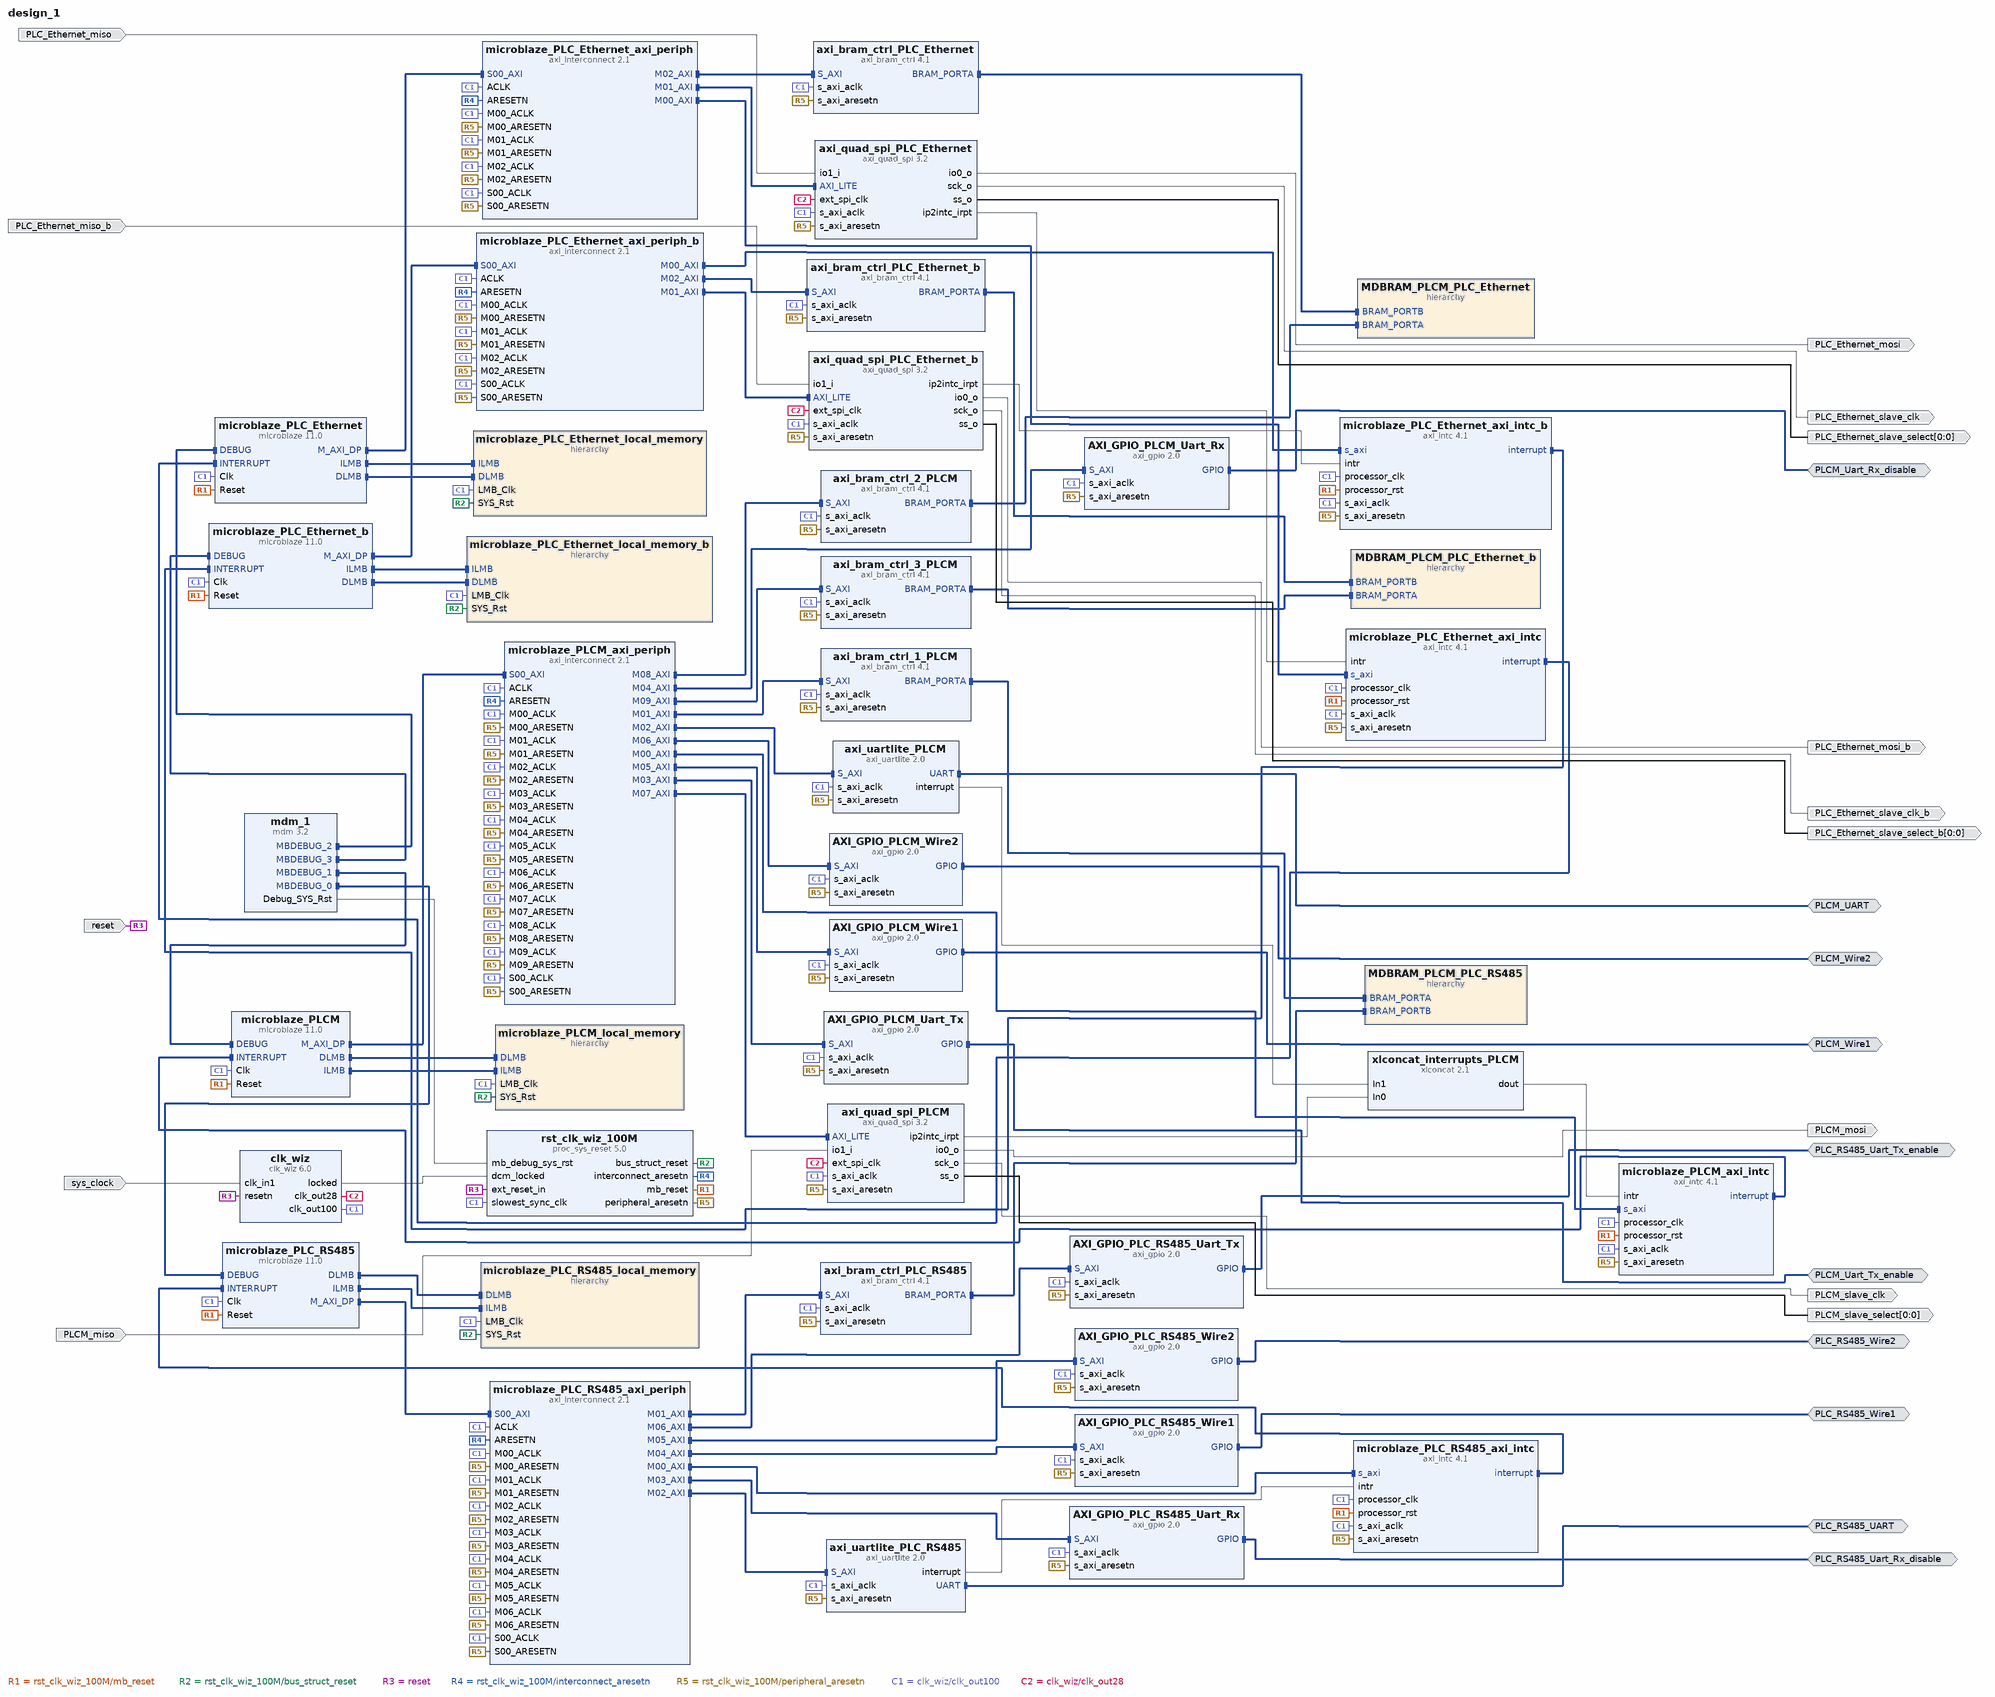
[diagram p0: block diagram of the top level]
# Vivado block design design_1, xc7z020clg400-1, Vivado 2019.1
create_bd_design design_1

create_bd_intf_port -mode Master -vlnv xilinx.com:interface:uart_rtl:1.0 PLC_RS485_UART
create_bd_intf_port -mode Master -vlnv xilinx.com:interface:uart_rtl:1.0 PLCM_UART
create_bd_intf_port -mode Master -vlnv xilinx.com:interface:gpio_rtl:1.0 PLC_RS485_Uart_Rx_disable
create_bd_intf_port -mode Master -vlnv xilinx.com:interface:gpio_rtl:1.0 PLCM_Uart_Rx_disable
create_bd_intf_port -mode Master -vlnv xilinx.com:interface:gpio_rtl:1.0 PLCM_Uart_Tx_enable
create_bd_intf_port -mode Master -vlnv xilinx.com:interface:gpio_rtl:1.0 PLC_RS485_Wire1
create_bd_intf_port -mode Master -vlnv xilinx.com:interface:gpio_rtl:1.0 PLC_RS485_Wire2
create_bd_intf_port -mode Master -vlnv xilinx.com:interface:gpio_rtl:1.0 PLCM_Wire1
create_bd_intf_port -mode Master -vlnv xilinx.com:interface:gpio_rtl:1.0 PLCM_Wire2
create_bd_intf_port -mode Master -vlnv xilinx.com:interface:gpio_rtl:1.0 PLC_RS485_Uart_Tx_enable
create_bd_port -dir I -type clk sys_clock
set_property -dict {CONFIG.FREQ_HZ 125000000 CONFIG.PHASE 0.000} [get_bd_ports sys_clock]
create_bd_port -dir I -type rst reset
set_property -dict {CONFIG.POLARITY ACTIVE_LOW} [get_bd_ports reset]
create_bd_port -dir O PLCM_mosi
create_bd_port -dir I PLCM_miso
create_bd_port -dir O PLCM_slave_clk
create_bd_port -dir O -from 0 -to 0 PLCM_slave_select
create_bd_port -dir I PLC_Ethernet_miso
create_bd_port -dir O PLC_Ethernet_mosi
create_bd_port -dir O PLC_Ethernet_slave_clk
create_bd_port -dir O -from 0 -to 0 PLC_Ethernet_slave_select
create_bd_port -dir I PLC_Ethernet_miso_b
create_bd_port -dir O PLC_Ethernet_mosi_b
create_bd_port -dir O PLC_Ethernet_slave_clk_b
create_bd_port -dir O -from 0 -to 0 PLC_Ethernet_slave_select_b

create_bd_cell -type ip -vlnv xilinx.com:ip:microblaze:11.0 microblaze_PLC_RS485
set_property -dict [list \
  CONFIG.C_DEBUG_ENABLED 1 \
  CONFIG.C_D_AXI 1 \
  CONFIG.C_D_LMB 1 \
  CONFIG.C_I_LMB 1 \
] [get_bd_cells microblaze_PLC_RS485]
create_bd_cell -type ip -vlnv xilinx.com:ip:microblaze:11.0 microblaze_PLCM
set_property -dict {CONFIG.C_DEBUG_ENABLED 1 CONFIG.C_D_AXI 1 CONFIG.C_D_LMB 1 CONFIG.C_I_LMB 1} [get_bd_cells microblaze_PLCM]
create_bd_cell -type ip -vlnv xilinx.com:ip:clk_wiz:6.0 clk_wiz
set_property -dict [list \
  CONFIG.CLKIN1_JITTER_PS 80.0 \
  CONFIG.CLKOUT1_JITTER 290.778 \
  CONFIG.CLKOUT1_PHASE_ERROR 301.898 \
  CONFIG.CLKOUT1_REQUESTED_OUT_FREQ 100.000 \
  CONFIG.CLKOUT2_JITTER 374.460 \
  CONFIG.CLKOUT2_PHASE_ERROR 301.898 \
  CONFIG.CLKOUT2_REQUESTED_OUT_FREQ 28.000 \
  CONFIG.CLKOUT2_USED true \
  CONFIG.CLK_IN1_BOARD_INTERFACE sys_clock \
  CONFIG.CLK_OUT1_PORT clk_out100 \
  CONFIG.CLK_OUT2_PORT clk_out28 \
  CONFIG.MMCM_CLKFBOUT_MULT_F 28.000 \
  CONFIG.MMCM_CLKIN1_PERIOD 8.000 \
  CONFIG.MMCM_CLKIN2_PERIOD 10.0 \
  CONFIG.MMCM_CLKOUT0_DIVIDE_F 7.000 \
  CONFIG.MMCM_CLKOUT1_DIVIDE 25 \
  CONFIG.MMCM_DIVCLK_DIVIDE 5 \
  CONFIG.NUM_OUT_CLKS 2 \
  CONFIG.RESET_PORT resetn \
  CONFIG.RESET_TYPE ACTIVE_LOW \
  CONFIG.USE_BOARD_FLOW true \
] [get_bd_cells clk_wiz]
create_bd_cell -type hier microblaze_PLC_RS485_local_memory
create_bd_cell -type ip -vlnv xilinx.com:ip:axi_interconnect:2.1 microblaze_PLC_RS485_axi_periph
set_property -dict {CONFIG.NUM_MI 7} [get_bd_cells microblaze_PLC_RS485_axi_periph]
create_bd_cell -type ip -vlnv xilinx.com:ip:axi_intc:4.1 microblaze_PLC_RS485_axi_intc
set_property -dict {CONFIG.C_HAS_FAST 1} [get_bd_cells microblaze_PLC_RS485_axi_intc]
create_bd_cell -type ip -vlnv xilinx.com:ip:mdm:3.2 mdm_1
set_property -dict {CONFIG.C_ADDR_SIZE 32 CONFIG.C_MB_DBG_PORTS 4 CONFIG.C_M_AXI_ADDR_WIDTH 32} [get_bd_cells mdm_1]
create_bd_cell -type ip -vlnv xilinx.com:ip:proc_sys_reset:5.0 rst_clk_wiz_100M
create_bd_cell -type hier microblaze_PLCM_local_memory
create_bd_cell -type ip -vlnv xilinx.com:ip:axi_interconnect:2.1 microblaze_PLCM_axi_periph
set_property -dict {CONFIG.NUM_MI 10} [get_bd_cells microblaze_PLCM_axi_periph]
create_bd_cell -type ip -vlnv xilinx.com:ip:axi_intc:4.1 microblaze_PLCM_axi_intc
set_property -dict {CONFIG.C_HAS_FAST 1} [get_bd_cells microblaze_PLCM_axi_intc]
create_bd_cell -type ip -vlnv xilinx.com:ip:axi_bram_ctrl:4.1 axi_bram_ctrl_PLC_RS485
set_property -dict {CONFIG.SINGLE_PORT_BRAM 1} [get_bd_cells axi_bram_ctrl_PLC_RS485]
create_bd_cell -type ip -vlnv xilinx.com:ip:axi_bram_ctrl:4.1 axi_bram_ctrl_1_PLCM
set_property -dict {CONFIG.SINGLE_PORT_BRAM 1} [get_bd_cells axi_bram_ctrl_1_PLCM]
create_bd_cell -type ip -vlnv xilinx.com:ip:axi_uartlite:2.0 axi_uartlite_PLC_RS485
set_property -dict {CONFIG.C_BAUDRATE 115200 CONFIG.C_USE_PARITY 1 CONFIG.PARITY Even} [get_bd_cells axi_uartlite_PLC_RS485]
create_bd_cell -type ip -vlnv xilinx.com:ip:axi_uartlite:2.0 axi_uartlite_PLCM
set_property -dict {CONFIG.C_BAUDRATE 115200 CONFIG.C_USE_PARITY 1 CONFIG.PARITY Even} [get_bd_cells axi_uartlite_PLCM]
create_bd_cell -type ip -vlnv xilinx.com:ip:axi_gpio:2.0 AXI_GPIO_PLC_RS485_Uart_Rx
set_property -dict [list \
  CONFIG.C_ALL_INPUTS 0 \
  CONFIG.C_ALL_OUTPUTS 1 \
  CONFIG.C_GPIO_WIDTH 1 \
  CONFIG.GPIO_BOARD_INTERFACE Custom \
  CONFIG.USE_BOARD_FLOW true \
] [get_bd_cells AXI_GPIO_PLC_RS485_Uart_Rx]
create_bd_cell -type ip -vlnv xilinx.com:ip:axi_gpio:2.0 AXI_GPIO_PLCM_Uart_Rx
set_property -dict [list \
  CONFIG.C_ALL_INPUTS 0 \
  CONFIG.C_ALL_OUTPUTS 1 \
  CONFIG.C_GPIO_WIDTH 1 \
  CONFIG.GPIO_BOARD_INTERFACE Custom \
  CONFIG.USE_BOARD_FLOW true \
] [get_bd_cells AXI_GPIO_PLCM_Uart_Rx]
create_bd_cell -type ip -vlnv xilinx.com:ip:axi_gpio:2.0 AXI_GPIO_PLCM_Uart_Tx
set_property -dict [list \
  CONFIG.C_ALL_INPUTS 0 \
  CONFIG.C_ALL_OUTPUTS 1 \
  CONFIG.C_GPIO_WIDTH 1 \
  CONFIG.GPIO_BOARD_INTERFACE Custom \
  CONFIG.USE_BOARD_FLOW true \
] [get_bd_cells AXI_GPIO_PLCM_Uart_Tx]
create_bd_cell -type ip -vlnv xilinx.com:ip:axi_gpio:2.0 AXI_GPIO_PLC_RS485_Wire1
set_property -dict {CONFIG.C_GPIO_WIDTH 1 CONFIG.C_TRI_DEFAULT 0x00000001} [get_bd_cells AXI_GPIO_PLC_RS485_Wire1]
create_bd_cell -type ip -vlnv xilinx.com:ip:axi_gpio:2.0 AXI_GPIO_PLC_RS485_Wire2
set_property -dict {CONFIG.C_GPIO_WIDTH 1 CONFIG.C_TRI_DEFAULT 0x00000001} [get_bd_cells AXI_GPIO_PLC_RS485_Wire2]
create_bd_cell -type ip -vlnv xilinx.com:ip:axi_gpio:2.0 AXI_GPIO_PLCM_Wire1
set_property -dict {CONFIG.C_GPIO_WIDTH 1 CONFIG.C_TRI_DEFAULT 0x00000001} [get_bd_cells AXI_GPIO_PLCM_Wire1]
create_bd_cell -type ip -vlnv xilinx.com:ip:axi_gpio:2.0 AXI_GPIO_PLCM_Wire2
set_property -dict {CONFIG.C_GPIO_WIDTH 1 CONFIG.C_TRI_DEFAULT 0x00000001} [get_bd_cells AXI_GPIO_PLCM_Wire2]
create_bd_cell -type ip -vlnv xilinx.com:ip:axi_quad_spi:3.2 axi_quad_spi_PLCM
set_property -dict {CONFIG.C_FIFO_DEPTH 256 CONFIG.C_SCK_RATIO 2 CONFIG.C_USE_STARTUP 0} [get_bd_cells axi_quad_spi_PLCM]
create_bd_cell -type ip -vlnv xilinx.com:ip:xlconcat:2.1 xlconcat_interrupts_PLCM
create_bd_cell -type ip -vlnv xilinx.com:ip:microblaze:11.0 microblaze_PLC_Ethernet
set_property -dict [list \
  CONFIG.C_DEBUG_ENABLED 1 \
  CONFIG.C_D_AXI 1 \
  CONFIG.C_D_LMB 1 \
  CONFIG.C_I_LMB 1 \
] [get_bd_cells microblaze_PLC_Ethernet]
create_bd_cell -type ip -vlnv xilinx.com:ip:axi_interconnect:2.1 microblaze_PLC_Ethernet_axi_periph
set_property -dict {CONFIG.NUM_MI 3} [get_bd_cells microblaze_PLC_Ethernet_axi_periph]
create_bd_cell -type ip -vlnv xilinx.com:ip:axi_intc:4.1 microblaze_PLC_Ethernet_axi_intc
set_property -dict {CONFIG.C_HAS_FAST 1} [get_bd_cells microblaze_PLC_Ethernet_axi_intc]
create_bd_cell -type ip -vlnv xilinx.com:ip:axi_quad_spi:3.2 axi_quad_spi_PLC_Ethernet
set_property -dict {CONFIG.C_FIFO_DEPTH 256 CONFIG.C_SCK_RATIO 2 CONFIG.C_USE_STARTUP 0} [get_bd_cells axi_quad_spi_PLC_Ethernet]
create_bd_cell -type ip -vlnv xilinx.com:ip:axi_bram_ctrl:4.1 axi_bram_ctrl_2_PLCM
set_property -dict {CONFIG.SINGLE_PORT_BRAM 1} [get_bd_cells axi_bram_ctrl_2_PLCM]
create_bd_cell -type ip -vlnv xilinx.com:ip:axi_bram_ctrl:4.1 axi_bram_ctrl_PLC_Ethernet
set_property -dict {CONFIG.SINGLE_PORT_BRAM 1} [get_bd_cells axi_bram_ctrl_PLC_Ethernet]
create_bd_cell -type hier microblaze_PLC_Ethernet_local_memory
create_bd_cell -type hier MDBRAM_PLCM_PLC_Ethernet
create_bd_cell -type hier MDBRAM_PLCM_PLC_RS485
create_bd_cell -type hier MDBRAM_PLCM_PLC_Ethernet_b
create_bd_cell -type ip -vlnv xilinx.com:ip:axi_bram_ctrl:4.1 axi_bram_ctrl_PLC_Ethernet_b
set_property -dict {CONFIG.SINGLE_PORT_BRAM 1} [get_bd_cells axi_bram_ctrl_PLC_Ethernet_b]
create_bd_cell -type ip -vlnv xilinx.com:ip:axi_quad_spi:3.2 axi_quad_spi_PLC_Ethernet_b
set_property -dict [list \
  CONFIG.C_FIFO_DEPTH 256 \
  CONFIG.C_SCK_RATIO 2 \
  CONFIG.C_USE_STARTUP 0 \
] [get_bd_cells axi_quad_spi_PLC_Ethernet_b]
create_bd_cell -type ip -vlnv xilinx.com:ip:microblaze:11.0 microblaze_PLC_Ethernet_b
set_property -dict [list \
  CONFIG.C_DEBUG_ENABLED 1 \
  CONFIG.C_D_AXI 1 \
  CONFIG.C_D_LMB 1 \
  CONFIG.C_I_LMB 1 \
] [get_bd_cells microblaze_PLC_Ethernet_b]
create_bd_cell -type ip -vlnv xilinx.com:ip:axi_intc:4.1 microblaze_PLC_Ethernet_axi_intc_b
set_property -dict {CONFIG.C_HAS_FAST 1} [get_bd_cells microblaze_PLC_Ethernet_axi_intc_b]
create_bd_cell -type ip -vlnv xilinx.com:ip:axi_interconnect:2.1 microblaze_PLC_Ethernet_axi_periph_b
set_property -dict {CONFIG.NUM_MI 3} [get_bd_cells microblaze_PLC_Ethernet_axi_periph_b]
create_bd_cell -type hier microblaze_PLC_Ethernet_local_memory_b
create_bd_cell -type ip -vlnv xilinx.com:ip:axi_bram_ctrl:4.1 axi_bram_ctrl_3_PLCM
set_property -dict {CONFIG.SINGLE_PORT_BRAM 1} [get_bd_cells axi_bram_ctrl_3_PLCM]
create_bd_cell -type ip -vlnv xilinx.com:ip:axi_gpio:2.0 AXI_GPIO_PLC_RS485_Uart_Tx
set_property -dict [list \
  CONFIG.C_ALL_INPUTS 0 \
  CONFIG.C_ALL_OUTPUTS 1 \
  CONFIG.C_GPIO_WIDTH 1 \
  CONFIG.GPIO_BOARD_INTERFACE Custom \
  CONFIG.USE_BOARD_FLOW true \
] [get_bd_cells AXI_GPIO_PLC_RS485_Uart_Tx]

# ---- hierarchy /microblaze_PLC_RS485_local_memory ----
current_bd_instance /microblaze_PLC_RS485_local_memory
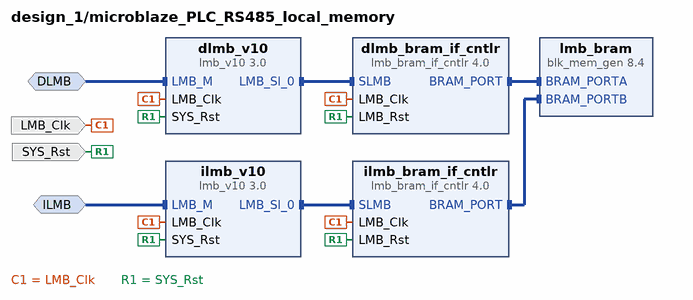
[diagram p1: block diagram inside /microblaze_PLC_RS485_local_memory]
create_bd_intf_pin -mode MirroredMaster -vlnv xilinx.com:interface:lmb_rtl:1.0 DLMB
create_bd_intf_pin -mode MirroredMaster -vlnv xilinx.com:interface:lmb_rtl:1.0 ILMB
create_bd_pin -dir I -type clk LMB_Clk
create_bd_pin -dir I -type rst SYS_Rst

create_bd_cell -type ip -vlnv xilinx.com:ip:lmb_v10:3.0 dlmb_v10
create_bd_cell -type ip -vlnv xilinx.com:ip:lmb_v10:3.0 ilmb_v10
create_bd_cell -type ip -vlnv xilinx.com:ip:lmb_bram_if_cntlr:4.0 dlmb_bram_if_cntlr
set_property -dict {CONFIG.C_ECC 0} [get_bd_cells dlmb_bram_if_cntlr]
create_bd_cell -type ip -vlnv xilinx.com:ip:lmb_bram_if_cntlr:4.0 ilmb_bram_if_cntlr
set_property -dict {CONFIG.C_ECC 0} [get_bd_cells ilmb_bram_if_cntlr]
create_bd_cell -type ip -vlnv xilinx.com:ip:blk_mem_gen:8.4 lmb_bram
set_property -dict {CONFIG.Memory_Type True_Dual_Port_RAM CONFIG.use_bram_block BRAM_Controller} [get_bd_cells lmb_bram]

# ---- hierarchy /microblaze_PLCM_local_memory ----
current_bd_instance /microblaze_PLCM_local_memory
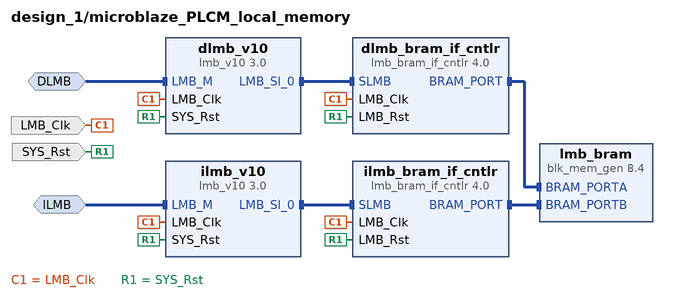
[diagram p2: block diagram inside /microblaze_PLCM_local_memory]
create_bd_intf_pin -mode MirroredMaster -vlnv xilinx.com:interface:lmb_rtl:1.0 DLMB
create_bd_intf_pin -mode MirroredMaster -vlnv xilinx.com:interface:lmb_rtl:1.0 ILMB
create_bd_pin -dir I -type clk LMB_Clk
create_bd_pin -dir I -type rst SYS_Rst

create_bd_cell -type ip -vlnv xilinx.com:ip:lmb_v10:3.0 dlmb_v10
create_bd_cell -type ip -vlnv xilinx.com:ip:lmb_v10:3.0 ilmb_v10
create_bd_cell -type ip -vlnv xilinx.com:ip:lmb_bram_if_cntlr:4.0 dlmb_bram_if_cntlr
set_property -dict {CONFIG.C_ECC 0} [get_bd_cells dlmb_bram_if_cntlr]
create_bd_cell -type ip -vlnv xilinx.com:ip:lmb_bram_if_cntlr:4.0 ilmb_bram_if_cntlr
set_property -dict {CONFIG.C_ECC 0} [get_bd_cells ilmb_bram_if_cntlr]
create_bd_cell -type ip -vlnv xilinx.com:ip:blk_mem_gen:8.4 lmb_bram
set_property -dict {CONFIG.Memory_Type True_Dual_Port_RAM CONFIG.use_bram_block BRAM_Controller} [get_bd_cells lmb_bram]

# ---- hierarchy /microblaze_PLC_Ethernet_local_memory ----
current_bd_instance /microblaze_PLC_Ethernet_local_memory
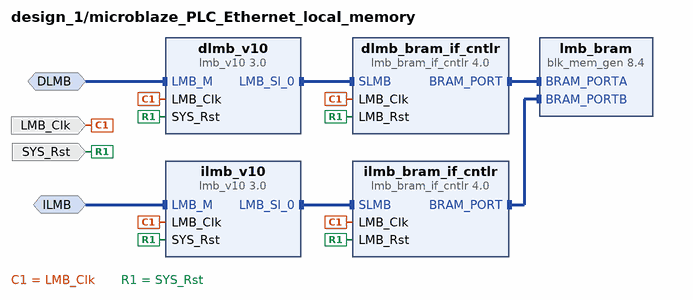
[diagram p3: block diagram inside /microblaze_PLC_Ethernet_local_memory]
create_bd_intf_pin -mode MirroredMaster -vlnv xilinx.com:interface:lmb_rtl:1.0 DLMB
create_bd_intf_pin -mode MirroredMaster -vlnv xilinx.com:interface:lmb_rtl:1.0 ILMB
create_bd_pin -dir I -type clk LMB_Clk
create_bd_pin -dir I -type rst SYS_Rst

create_bd_cell -type ip -vlnv xilinx.com:ip:lmb_v10:3.0 dlmb_v10
create_bd_cell -type ip -vlnv xilinx.com:ip:lmb_v10:3.0 ilmb_v10
create_bd_cell -type ip -vlnv xilinx.com:ip:lmb_bram_if_cntlr:4.0 dlmb_bram_if_cntlr
set_property -dict {CONFIG.C_ECC 0} [get_bd_cells dlmb_bram_if_cntlr]
create_bd_cell -type ip -vlnv xilinx.com:ip:lmb_bram_if_cntlr:4.0 ilmb_bram_if_cntlr
set_property -dict {CONFIG.C_ECC 0} [get_bd_cells ilmb_bram_if_cntlr]
create_bd_cell -type ip -vlnv xilinx.com:ip:blk_mem_gen:8.4 lmb_bram
set_property -dict {CONFIG.Memory_Type True_Dual_Port_RAM CONFIG.use_bram_block BRAM_Controller} [get_bd_cells lmb_bram]

# ---- hierarchy /MDBRAM_PLCM_PLC_Ethernet ----
current_bd_instance /MDBRAM_PLCM_PLC_Ethernet
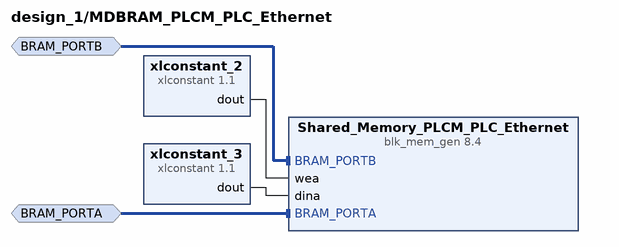
[diagram p4: block diagram inside /MDBRAM_PLCM_PLC_Ethernet]
create_bd_intf_pin -mode Slave -vlnv xilinx.com:interface:bram_rtl:1.0 BRAM_PORTA
create_bd_intf_pin -mode Slave -vlnv xilinx.com:interface:bram_rtl:1.0 BRAM_PORTB

create_bd_cell -type ip -vlnv xilinx.com:ip:blk_mem_gen:8.4 Shared_Memory_PLCM_PLC_Ethernet
set_property -dict [list \
  CONFIG.EN_SAFETY_CKT true \
  CONFIG.Enable_32bit_Address true \
  CONFIG.Enable_B Use_ENB_Pin \
  CONFIG.Memory_Type True_Dual_Port_RAM \
  CONFIG.Port_B_Clock 100 \
  CONFIG.Port_B_Enable_Rate 100 \
  CONFIG.Port_B_Write_Rate 50 \
  CONFIG.Register_PortA_Output_of_Memory_Primitives false \
  CONFIG.Use_RSTA_Pin true \
  CONFIG.Use_RSTB_Pin true \
  CONFIG.use_bram_block BRAM_Controller \
] [get_bd_cells Shared_Memory_PLCM_PLC_Ethernet]
create_bd_cell -type ip -vlnv xilinx.com:ip:xlconstant:1.1 xlconstant_2
set_property -dict {CONFIG.CONST_VAL 0 CONFIG.CONST_WIDTH 4} [get_bd_cells xlconstant_2]
create_bd_cell -type ip -vlnv xilinx.com:ip:xlconstant:1.1 xlconstant_3
set_property -dict {CONFIG.CONST_VAL 0 CONFIG.CONST_WIDTH 32} [get_bd_cells xlconstant_3]

# ---- hierarchy /MDBRAM_PLCM_PLC_RS485 ----
current_bd_instance /MDBRAM_PLCM_PLC_RS485
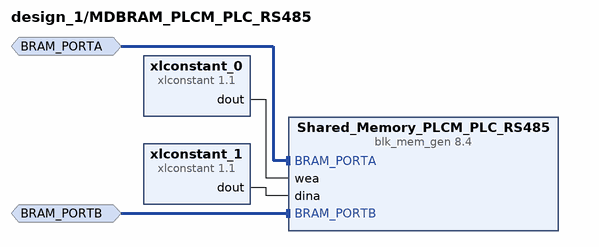
[diagram p5: block diagram inside /MDBRAM_PLCM_PLC_RS485]
create_bd_intf_pin -mode Slave -vlnv xilinx.com:interface:bram_rtl:1.0 BRAM_PORTA
create_bd_intf_pin -mode Slave -vlnv xilinx.com:interface:bram_rtl:1.0 BRAM_PORTB

create_bd_cell -type ip -vlnv xilinx.com:ip:xlconstant:1.1 xlconstant_0
set_property -dict {CONFIG.CONST_VAL 0 CONFIG.CONST_WIDTH 4} [get_bd_cells xlconstant_0]
create_bd_cell -type ip -vlnv xilinx.com:ip:blk_mem_gen:8.4 Shared_Memory_PLCM_PLC_RS485
set_property -dict [list \
  CONFIG.EN_SAFETY_CKT true \
  CONFIG.Enable_32bit_Address true \
  CONFIG.Enable_B Use_ENB_Pin \
  CONFIG.Memory_Type True_Dual_Port_RAM \
  CONFIG.Port_B_Clock 100 \
  CONFIG.Port_B_Enable_Rate 100 \
  CONFIG.Port_B_Write_Rate 50 \
  CONFIG.Register_PortA_Output_of_Memory_Primitives false \
  CONFIG.Use_RSTA_Pin true \
  CONFIG.Use_RSTB_Pin true \
  CONFIG.use_bram_block BRAM_Controller \
] [get_bd_cells Shared_Memory_PLCM_PLC_RS485]
create_bd_cell -type ip -vlnv xilinx.com:ip:xlconstant:1.1 xlconstant_1
set_property -dict {CONFIG.CONST_VAL 0 CONFIG.CONST_WIDTH 32} [get_bd_cells xlconstant_1]

# ---- hierarchy /MDBRAM_PLCM_PLC_Ethernet_b ----
current_bd_instance /MDBRAM_PLCM_PLC_Ethernet_b
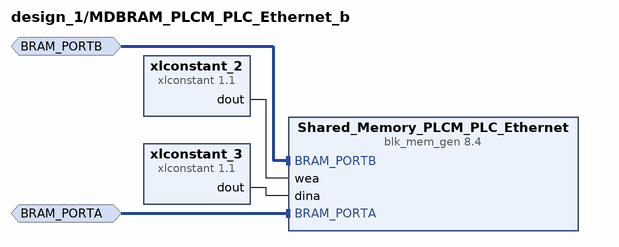
[diagram p6: block diagram inside /MDBRAM_PLCM_PLC_Ethernet_b]
create_bd_intf_pin -mode Slave -vlnv xilinx.com:interface:bram_rtl:1.0 BRAM_PORTA
create_bd_intf_pin -mode Slave -vlnv xilinx.com:interface:bram_rtl:1.0 BRAM_PORTB

create_bd_cell -type ip -vlnv xilinx.com:ip:blk_mem_gen:8.4 Shared_Memory_PLCM_PLC_Ethernet
set_property -dict [list \
  CONFIG.EN_SAFETY_CKT true \
  CONFIG.Enable_32bit_Address true \
  CONFIG.Enable_B Use_ENB_Pin \
  CONFIG.Memory_Type True_Dual_Port_RAM \
  CONFIG.Port_B_Clock 100 \
  CONFIG.Port_B_Enable_Rate 100 \
  CONFIG.Port_B_Write_Rate 50 \
  CONFIG.Register_PortA_Output_of_Memory_Primitives false \
  CONFIG.Use_RSTA_Pin true \
  CONFIG.Use_RSTB_Pin true \
  CONFIG.use_bram_block BRAM_Controller \
] [get_bd_cells Shared_Memory_PLCM_PLC_Ethernet]
create_bd_cell -type ip -vlnv xilinx.com:ip:xlconstant:1.1 xlconstant_2
set_property -dict {CONFIG.CONST_VAL 0 CONFIG.CONST_WIDTH 4} [get_bd_cells xlconstant_2]
create_bd_cell -type ip -vlnv xilinx.com:ip:xlconstant:1.1 xlconstant_3
set_property -dict {CONFIG.CONST_VAL 0 CONFIG.CONST_WIDTH 32} [get_bd_cells xlconstant_3]

# ---- hierarchy /microblaze_PLC_Ethernet_local_memory_b ----
current_bd_instance /microblaze_PLC_Ethernet_local_memory_b
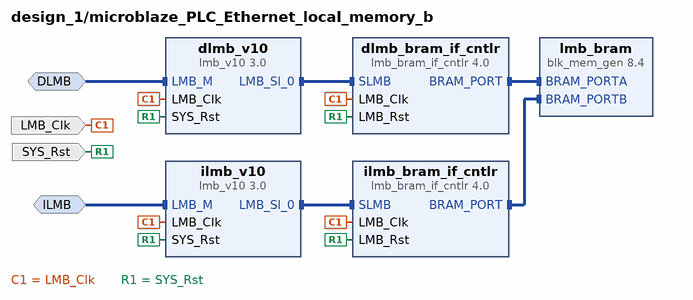
[diagram p7: block diagram inside /microblaze_PLC_Ethernet_local_memory_b]
create_bd_intf_pin -mode MirroredMaster -vlnv xilinx.com:interface:lmb_rtl:1.0 DLMB
create_bd_intf_pin -mode MirroredMaster -vlnv xilinx.com:interface:lmb_rtl:1.0 ILMB
create_bd_pin -dir I -type clk LMB_Clk
create_bd_pin -dir I -type rst SYS_Rst

create_bd_cell -type ip -vlnv xilinx.com:ip:lmb_v10:3.0 dlmb_v10
create_bd_cell -type ip -vlnv xilinx.com:ip:lmb_v10:3.0 ilmb_v10
create_bd_cell -type ip -vlnv xilinx.com:ip:lmb_bram_if_cntlr:4.0 dlmb_bram_if_cntlr
set_property -dict {CONFIG.C_ECC 0} [get_bd_cells dlmb_bram_if_cntlr]
create_bd_cell -type ip -vlnv xilinx.com:ip:lmb_bram_if_cntlr:4.0 ilmb_bram_if_cntlr
set_property -dict {CONFIG.C_ECC 0} [get_bd_cells ilmb_bram_if_cntlr]
create_bd_cell -type ip -vlnv xilinx.com:ip:blk_mem_gen:8.4 lmb_bram
set_property -dict {CONFIG.Memory_Type True_Dual_Port_RAM CONFIG.use_bram_block BRAM_Controller} [get_bd_cells lmb_bram]

# ---- connections ----

current_bd_instance /microblaze_PLC_RS485_local_memory
connect_bd_intf_net [get_bd_intf_pins dlmb_bram_if_cntlr/BRAM_PORT] [get_bd_intf_pins lmb_bram/BRAM_PORTA]
connect_bd_intf_net [get_bd_intf_pins ILMB] [get_bd_intf_pins ilmb_v10/LMB_M]
connect_bd_intf_net [get_bd_intf_pins ilmb_bram_if_cntlr/BRAM_PORT] [get_bd_intf_pins lmb_bram/BRAM_PORTB]
connect_bd_intf_net [get_bd_intf_pins dlmb_v10/LMB_Sl_0] [get_bd_intf_pins dlmb_bram_if_cntlr/SLMB]
connect_bd_intf_net [get_bd_intf_pins ilmb_v10/LMB_Sl_0] [get_bd_intf_pins ilmb_bram_if_cntlr/SLMB]
connect_bd_intf_net [get_bd_intf_pins DLMB] [get_bd_intf_pins dlmb_v10/LMB_M]
connect_bd_net -net microblaze_PLC_Clk [get_bd_pins LMB_Clk] \
  [get_bd_pins dlmb_v10/LMB_Clk] [get_bd_pins dlmb_bram_if_cntlr/LMB_Clk] [get_bd_pins ilmb_v10/LMB_Clk] \
  [get_bd_pins ilmb_bram_if_cntlr/LMB_Clk]
connect_bd_net [get_bd_pins SYS_Rst] \
  [get_bd_pins dlmb_v10/SYS_Rst] [get_bd_pins dlmb_bram_if_cntlr/LMB_Rst] [get_bd_pins ilmb_v10/SYS_Rst] \
  [get_bd_pins ilmb_bram_if_cntlr/LMB_Rst]
set_property HDL_ATTRIBUTE.BMM_INFO_ADDRESS_SPACE {byte  0x00000000 32 > design_1 microblaze_PLC_RS485_local_memory/lmb_bram} [get_bd_cells dlmb_bram_if_cntlr]
set_property HDL_ATTRIBUTE.KEEP_HIERARCHY yes [get_bd_cells dlmb_bram_if_cntlr]

current_bd_instance /microblaze_PLCM_local_memory
connect_bd_intf_net [get_bd_intf_pins ilmb_bram_if_cntlr/BRAM_PORT] [get_bd_intf_pins lmb_bram/BRAM_PORTB]
connect_bd_intf_net [get_bd_intf_pins DLMB] [get_bd_intf_pins dlmb_v10/LMB_M]
connect_bd_intf_net [get_bd_intf_pins ILMB] [get_bd_intf_pins ilmb_v10/LMB_M]
connect_bd_intf_net [get_bd_intf_pins dlmb_bram_if_cntlr/BRAM_PORT] [get_bd_intf_pins lmb_bram/BRAM_PORTA]
connect_bd_intf_net [get_bd_intf_pins dlmb_v10/LMB_Sl_0] [get_bd_intf_pins dlmb_bram_if_cntlr/SLMB]
connect_bd_intf_net [get_bd_intf_pins ilmb_v10/LMB_Sl_0] [get_bd_intf_pins ilmb_bram_if_cntlr/SLMB]
connect_bd_net -net microblaze_MPLC_Clk [get_bd_pins LMB_Clk] \
  [get_bd_pins dlmb_v10/LMB_Clk] [get_bd_pins dlmb_bram_if_cntlr/LMB_Clk] [get_bd_pins ilmb_v10/LMB_Clk] \
  [get_bd_pins ilmb_bram_if_cntlr/LMB_Clk]
connect_bd_net [get_bd_pins SYS_Rst] \
  [get_bd_pins dlmb_v10/SYS_Rst] [get_bd_pins dlmb_bram_if_cntlr/LMB_Rst] [get_bd_pins ilmb_v10/SYS_Rst] \
  [get_bd_pins ilmb_bram_if_cntlr/LMB_Rst]
set_property HDL_ATTRIBUTE.BMM_INFO_ADDRESS_SPACE {byte  0x00000000 32 > design_1 microblaze_PLCM_local_memory/lmb_bram} [get_bd_cells dlmb_bram_if_cntlr]
set_property HDL_ATTRIBUTE.KEEP_HIERARCHY yes [get_bd_cells dlmb_bram_if_cntlr]

current_bd_instance /microblaze_PLC_Ethernet_local_memory
connect_bd_intf_net [get_bd_intf_pins DLMB] [get_bd_intf_pins dlmb_v10/LMB_M]
connect_bd_intf_net [get_bd_intf_pins dlmb_bram_if_cntlr/BRAM_PORT] [get_bd_intf_pins lmb_bram/BRAM_PORTA]
connect_bd_intf_net [get_bd_intf_pins ilmb_bram_if_cntlr/BRAM_PORT] [get_bd_intf_pins lmb_bram/BRAM_PORTB]
connect_bd_intf_net [get_bd_intf_pins ILMB] [get_bd_intf_pins ilmb_v10/LMB_M]
connect_bd_intf_net [get_bd_intf_pins dlmb_v10/LMB_Sl_0] [get_bd_intf_pins dlmb_bram_if_cntlr/SLMB]
connect_bd_intf_net [get_bd_intf_pins ilmb_v10/LMB_Sl_0] [get_bd_intf_pins ilmb_bram_if_cntlr/SLMB]
connect_bd_net -net microblaze_0_Clk [get_bd_pins LMB_Clk] \
  [get_bd_pins dlmb_v10/LMB_Clk] [get_bd_pins dlmb_bram_if_cntlr/LMB_Clk] [get_bd_pins ilmb_v10/LMB_Clk] \
  [get_bd_pins ilmb_bram_if_cntlr/LMB_Clk]
connect_bd_net [get_bd_pins SYS_Rst] \
  [get_bd_pins dlmb_v10/SYS_Rst] [get_bd_pins dlmb_bram_if_cntlr/LMB_Rst] [get_bd_pins ilmb_v10/SYS_Rst] \
  [get_bd_pins ilmb_bram_if_cntlr/LMB_Rst]
set_property HDL_ATTRIBUTE.BMM_INFO_ADDRESS_SPACE {byte  0x00000000 32 > design_1 microblaze_PLC_Ethernet_local_memory/lmb_bram} [get_bd_cells dlmb_bram_if_cntlr]
set_property HDL_ATTRIBUTE.KEEP_HIERARCHY yes [get_bd_cells dlmb_bram_if_cntlr]

current_bd_instance /MDBRAM_PLCM_PLC_Ethernet
connect_bd_intf_net [get_bd_intf_pins BRAM_PORTB] [get_bd_intf_pins Shared_Memory_PLCM_PLC_Ethernet/BRAM_PORTB]
connect_bd_intf_net [get_bd_intf_pins BRAM_PORTA] [get_bd_intf_pins Shared_Memory_PLCM_PLC_Ethernet/BRAM_PORTA]
connect_bd_net [get_bd_pins xlconstant_2/dout] [get_bd_pins Shared_Memory_PLCM_PLC_Ethernet/wea]
connect_bd_net [get_bd_pins xlconstant_3/dout] [get_bd_pins Shared_Memory_PLCM_PLC_Ethernet/dina]

current_bd_instance /MDBRAM_PLCM_PLC_RS485
connect_bd_intf_net [get_bd_intf_pins BRAM_PORTA] [get_bd_intf_pins Shared_Memory_PLCM_PLC_RS485/BRAM_PORTA]
connect_bd_intf_net [get_bd_intf_pins BRAM_PORTB] [get_bd_intf_pins Shared_Memory_PLCM_PLC_RS485/BRAM_PORTB]
connect_bd_net [get_bd_pins xlconstant_0/dout] [get_bd_pins Shared_Memory_PLCM_PLC_RS485/wea]
connect_bd_net [get_bd_pins xlconstant_1/dout] [get_bd_pins Shared_Memory_PLCM_PLC_RS485/dina]

current_bd_instance /MDBRAM_PLCM_PLC_Ethernet_b
connect_bd_intf_net [get_bd_intf_pins BRAM_PORTB] [get_bd_intf_pins Shared_Memory_PLCM_PLC_Ethernet/BRAM_PORTB]
connect_bd_intf_net [get_bd_intf_pins BRAM_PORTA] [get_bd_intf_pins Shared_Memory_PLCM_PLC_Ethernet/BRAM_PORTA]
connect_bd_net [get_bd_pins xlconstant_2/dout] [get_bd_pins Shared_Memory_PLCM_PLC_Ethernet/wea]
connect_bd_net [get_bd_pins xlconstant_3/dout] [get_bd_pins Shared_Memory_PLCM_PLC_Ethernet/dina]

current_bd_instance /microblaze_PLC_Ethernet_local_memory_b
connect_bd_intf_net [get_bd_intf_pins dlmb_bram_if_cntlr/BRAM_PORT] [get_bd_intf_pins lmb_bram/BRAM_PORTA]
connect_bd_intf_net [get_bd_intf_pins ilmb_bram_if_cntlr/BRAM_PORT] [get_bd_intf_pins lmb_bram/BRAM_PORTB]
connect_bd_intf_net [get_bd_intf_pins dlmb_v10/LMB_Sl_0] [get_bd_intf_pins dlmb_bram_if_cntlr/SLMB]
connect_bd_intf_net [get_bd_intf_pins ILMB] [get_bd_intf_pins ilmb_v10/LMB_M]
connect_bd_intf_net [get_bd_intf_pins ilmb_v10/LMB_Sl_0] [get_bd_intf_pins ilmb_bram_if_cntlr/SLMB]
connect_bd_intf_net [get_bd_intf_pins DLMB] [get_bd_intf_pins dlmb_v10/LMB_M]
connect_bd_net -net microblaze_0_Clk [get_bd_pins LMB_Clk] \
  [get_bd_pins dlmb_v10/LMB_Clk] [get_bd_pins dlmb_bram_if_cntlr/LMB_Clk] [get_bd_pins ilmb_v10/LMB_Clk] \
  [get_bd_pins ilmb_bram_if_cntlr/LMB_Clk]
connect_bd_net [get_bd_pins SYS_Rst] \
  [get_bd_pins dlmb_v10/SYS_Rst] [get_bd_pins dlmb_bram_if_cntlr/LMB_Rst] [get_bd_pins ilmb_v10/SYS_Rst] \
  [get_bd_pins ilmb_bram_if_cntlr/LMB_Rst]
set_property HDL_ATTRIBUTE.BMM_INFO_ADDRESS_SPACE {byte  0x00000000 32 > design_1 microblaze_PLC_Ethernet_local_memory_b/lmb_bram} [get_bd_cells dlmb_bram_if_cntlr]
set_property HDL_ATTRIBUTE.KEEP_HIERARCHY yes [get_bd_cells dlmb_bram_if_cntlr]

current_bd_instance /
connect_bd_intf_net [get_bd_intf_ports PLC_RS485_Uart_Tx_enable] [get_bd_intf_pins AXI_GPIO_PLC_RS485_Uart_Tx/GPIO]
connect_bd_intf_net [get_bd_intf_pins AXI_GPIO_PLC_RS485_Uart_Tx/S_AXI] [get_bd_intf_pins microblaze_PLC_RS485_axi_periph/M06_AXI]
connect_bd_intf_net [get_bd_intf_pins microblaze_PLC_Ethernet_axi_intc_b/interrupt] [get_bd_intf_pins microblaze_PLC_Ethernet_b/INTERRUPT]
connect_bd_intf_net [get_bd_intf_pins mdm_1/MBDEBUG_3] [get_bd_intf_pins microblaze_PLC_Ethernet_b/DEBUG]
connect_bd_intf_net [get_bd_intf_pins microblaze_PLC_Ethernet_b/ILMB] [get_bd_intf_pins microblaze_PLC_Ethernet_local_memory_b/ILMB]
connect_bd_intf_net [get_bd_intf_pins microblaze_PLC_Ethernet_b/M_AXI_DP] [get_bd_intf_pins microblaze_PLC_Ethernet_axi_periph_b/S00_AXI]
connect_bd_intf_net [get_bd_intf_pins AXI_GPIO_PLC_RS485_Uart_Rx/S_AXI] [get_bd_intf_pins microblaze_PLC_RS485_axi_periph/M03_AXI]
connect_bd_intf_net [get_bd_intf_pins AXI_GPIO_PLC_RS485_Wire2/S_AXI] [get_bd_intf_pins microblaze_PLC_RS485_axi_periph/M05_AXI]
connect_bd_intf_net [get_bd_intf_pins microblaze_PLC_Ethernet/ILMB] [get_bd_intf_pins microblaze_PLC_Ethernet_local_memory/ILMB]
connect_bd_intf_net [get_bd_intf_pins microblaze_PLCM_axi_periph/M03_AXI] [get_bd_intf_pins AXI_GPIO_PLCM_Uart_Tx/S_AXI]
connect_bd_intf_net [get_bd_intf_pins microblaze_PLC_RS485_axi_intc/interrupt] [get_bd_intf_pins microblaze_PLC_RS485/INTERRUPT]
connect_bd_intf_net [get_bd_intf_ports PLCM_Wire2] [get_bd_intf_pins AXI_GPIO_PLCM_Wire2/GPIO]
connect_bd_intf_net [get_bd_intf_ports PLC_RS485_Wire2] [get_bd_intf_pins AXI_GPIO_PLC_RS485_Wire2/GPIO]
connect_bd_intf_net [get_bd_intf_pins axi_quad_spi_PLCM/AXI_LITE] [get_bd_intf_pins microblaze_PLCM_axi_periph/M07_AXI]
connect_bd_intf_net [get_bd_intf_pins microblaze_PLCM_axi_periph/M01_AXI] [get_bd_intf_pins axi_bram_ctrl_1_PLCM/S_AXI]
connect_bd_intf_net [get_bd_intf_pins microblaze_PLC_RS485_axi_periph/M02_AXI] [get_bd_intf_pins axi_uartlite_PLC_RS485/S_AXI]
connect_bd_intf_net [get_bd_intf_pins axi_bram_ctrl_2_PLCM/BRAM_PORTA] [get_bd_intf_pins MDBRAM_PLCM_PLC_Ethernet/BRAM_PORTA]
connect_bd_intf_net [get_bd_intf_pins microblaze_PLC_RS485/DLMB] [get_bd_intf_pins microblaze_PLC_RS485_local_memory/DLMB]
connect_bd_intf_net [get_bd_intf_pins microblaze_PLCM_axi_periph/M04_AXI] [get_bd_intf_pins AXI_GPIO_PLCM_Uart_Rx/S_AXI]
connect_bd_intf_net [get_bd_intf_pins axi_uartlite_PLCM/S_AXI] [get_bd_intf_pins microblaze_PLCM_axi_periph/M02_AXI]
connect_bd_intf_net [get_bd_intf_pins microblaze_PLCM_axi_periph/M00_AXI] [get_bd_intf_pins microblaze_PLCM_axi_intc/s_axi]
connect_bd_intf_net [get_bd_intf_pins microblaze_PLCM_axi_periph/S00_AXI] [get_bd_intf_pins microblaze_PLCM/M_AXI_DP]
connect_bd_intf_net [get_bd_intf_pins axi_bram_ctrl_PLC_RS485/BRAM_PORTA] [get_bd_intf_pins MDBRAM_PLCM_PLC_RS485/BRAM_PORTB]
connect_bd_intf_net [get_bd_intf_pins axi_bram_ctrl_2_PLCM/S_AXI] [get_bd_intf_pins microblaze_PLCM_axi_periph/M08_AXI]
connect_bd_intf_net [get_bd_intf_pins microblaze_PLCM/DLMB] [get_bd_intf_pins microblaze_PLCM_local_memory/DLMB]
connect_bd_intf_net [get_bd_intf_ports PLCM_UART] [get_bd_intf_pins axi_uartlite_PLCM/UART]
connect_bd_intf_net [get_bd_intf_pins microblaze_PLC_RS485_axi_periph/M00_AXI] [get_bd_intf_pins microblaze_PLC_RS485_axi_intc/s_axi]
connect_bd_intf_net [get_bd_intf_pins microblaze_PLC_RS485/ILMB] [get_bd_intf_pins microblaze_PLC_RS485_local_memory/ILMB]
connect_bd_intf_net [get_bd_intf_pins microblaze_PLC_Ethernet_axi_periph/M00_AXI] [get_bd_intf_pins microblaze_PLC_Ethernet_axi_intc/s_axi]
connect_bd_intf_net [get_bd_intf_pins mdm_1/MBDEBUG_2] [get_bd_intf_pins microblaze_PLC_Ethernet/DEBUG]
connect_bd_intf_net [get_bd_intf_pins axi_quad_spi_PLC_Ethernet/AXI_LITE] [get_bd_intf_pins microblaze_PLC_Ethernet_axi_periph/M01_AXI]
connect_bd_intf_net [get_bd_intf_pins AXI_GPIO_PLCM_Wire1/S_AXI] [get_bd_intf_pins microblaze_PLCM_axi_periph/M05_AXI]
connect_bd_intf_net [get_bd_intf_pins microblaze_PLC_Ethernet/DLMB] [get_bd_intf_pins microblaze_PLC_Ethernet_local_memory/DLMB]
connect_bd_intf_net [get_bd_intf_pins axi_bram_ctrl_PLC_RS485/S_AXI] [get_bd_intf_pins microblaze_PLC_RS485_axi_periph/M01_AXI]
connect_bd_intf_net [get_bd_intf_pins axi_bram_ctrl_1_PLCM/BRAM_PORTA] [get_bd_intf_pins MDBRAM_PLCM_PLC_RS485/BRAM_PORTA]
connect_bd_intf_net [get_bd_intf_pins microblaze_PLCM_axi_intc/interrupt] [get_bd_intf_pins microblaze_PLCM/INTERRUPT]
connect_bd_intf_net [get_bd_intf_pins mdm_1/MBDEBUG_1] [get_bd_intf_pins microblaze_PLCM/DEBUG]
connect_bd_intf_net [get_bd_intf_pins microblaze_PLC_RS485_axi_periph/S00_AXI] [get_bd_intf_pins microblaze_PLC_RS485/M_AXI_DP]
connect_bd_intf_net [get_bd_intf_ports PLCM_Uart_Rx_disable] [get_bd_intf_pins AXI_GPIO_PLCM_Uart_Rx/GPIO]
connect_bd_intf_net [get_bd_intf_ports PLC_RS485_Wire1] [get_bd_intf_pins AXI_GPIO_PLC_RS485_Wire1/GPIO]
connect_bd_intf_net [get_bd_intf_pins microblaze_PLCM/ILMB] [get_bd_intf_pins microblaze_PLCM_local_memory/ILMB]
connect_bd_intf_net [get_bd_intf_ports PLCM_Wire1] [get_bd_intf_pins AXI_GPIO_PLCM_Wire1/GPIO]
connect_bd_intf_net [get_bd_intf_pins axi_bram_ctrl_PLC_Ethernet/BRAM_PORTA] [get_bd_intf_pins MDBRAM_PLCM_PLC_Ethernet/BRAM_PORTB]
connect_bd_intf_net [get_bd_intf_pins AXI_GPIO_PLCM_Wire2/S_AXI] [get_bd_intf_pins microblaze_PLCM_axi_periph/M06_AXI]
connect_bd_intf_net [get_bd_intf_ports PLC_RS485_UART] [get_bd_intf_pins axi_uartlite_PLC_RS485/UART]
connect_bd_intf_net [get_bd_intf_pins microblaze_PLC_Ethernet_axi_intc/interrupt] [get_bd_intf_pins microblaze_PLC_Ethernet/INTERRUPT]
connect_bd_intf_net [get_bd_intf_pins axi_bram_ctrl_PLC_Ethernet/S_AXI] [get_bd_intf_pins microblaze_PLC_Ethernet_axi_periph/M02_AXI]
connect_bd_intf_net [get_bd_intf_ports PLCM_Uart_Tx_enable] [get_bd_intf_pins AXI_GPIO_PLCM_Uart_Tx/GPIO]
connect_bd_intf_net [get_bd_intf_ports PLC_RS485_Uart_Rx_disable] [get_bd_intf_pins AXI_GPIO_PLC_RS485_Uart_Rx/GPIO]
connect_bd_intf_net [get_bd_intf_pins microblaze_PLC_Ethernet_axi_periph/S00_AXI] [get_bd_intf_pins microblaze_PLC_Ethernet/M_AXI_DP]
connect_bd_intf_net [get_bd_intf_pins mdm_1/MBDEBUG_0] [get_bd_intf_pins microblaze_PLC_RS485/DEBUG]
connect_bd_intf_net [get_bd_intf_pins microblaze_PLC_Ethernet_b/DLMB] [get_bd_intf_pins microblaze_PLC_Ethernet_local_memory_b/DLMB]
connect_bd_intf_net [get_bd_intf_pins microblaze_PLC_Ethernet_axi_intc_b/s_axi] [get_bd_intf_pins microblaze_PLC_Ethernet_axi_periph_b/M00_AXI]
connect_bd_intf_net [get_bd_intf_pins AXI_GPIO_PLC_RS485_Wire1/S_AXI] [get_bd_intf_pins microblaze_PLC_RS485_axi_periph/M04_AXI]
connect_bd_intf_net [get_bd_intf_pins axi_bram_ctrl_PLC_Ethernet_b/S_AXI] [get_bd_intf_pins microblaze_PLC_Ethernet_axi_periph_b/M02_AXI]
connect_bd_intf_net [get_bd_intf_pins axi_quad_spi_PLC_Ethernet_b/AXI_LITE] [get_bd_intf_pins microblaze_PLC_Ethernet_axi_periph_b/M01_AXI]
connect_bd_intf_net [get_bd_intf_pins axi_bram_ctrl_3_PLCM/BRAM_PORTA] [get_bd_intf_pins MDBRAM_PLCM_PLC_Ethernet_b/BRAM_PORTA]
connect_bd_intf_net [get_bd_intf_pins axi_bram_ctrl_3_PLCM/S_AXI] [get_bd_intf_pins microblaze_PLCM_axi_periph/M09_AXI]
connect_bd_intf_net [get_bd_intf_pins MDBRAM_PLCM_PLC_Ethernet_b/BRAM_PORTB] [get_bd_intf_pins axi_bram_ctrl_PLC_Ethernet_b/BRAM_PORTA]
connect_bd_net [get_bd_pins clk_wiz/locked] [get_bd_pins rst_clk_wiz_100M/dcm_locked]
connect_bd_net -net rst_clk_wiz_150M_mb_reset [get_bd_pins rst_clk_wiz_100M/mb_reset] \
  [get_bd_pins microblaze_PLC_RS485/Reset] [get_bd_pins microblaze_PLC_RS485_axi_intc/processor_rst] \
  [get_bd_pins microblaze_PLCM/Reset] [get_bd_pins microblaze_PLCM_axi_intc/processor_rst] \
  [get_bd_pins microblaze_PLC_Ethernet/Reset] [get_bd_pins microblaze_PLC_Ethernet_axi_intc/processor_rst] \
  [get_bd_pins microblaze_PLC_Ethernet_b/Reset] [get_bd_pins microblaze_PLC_Ethernet_axi_intc_b/processor_rst]
connect_bd_net -net rst_clk_wiz_150M_bus_struct_reset [get_bd_pins rst_clk_wiz_100M/bus_struct_reset] \
  [get_bd_pins microblaze_PLC_RS485_local_memory/SYS_Rst] [get_bd_pins microblaze_PLCM_local_memory/SYS_Rst] \
  [get_bd_pins microblaze_PLC_Ethernet_local_memory/SYS_Rst] [get_bd_pins microblaze_PLC_Ethernet_local_memory_b/SYS_Rst]
connect_bd_net [get_bd_pins mdm_1/Debug_SYS_Rst] [get_bd_pins rst_clk_wiz_100M/mb_debug_sys_rst]
connect_bd_net [get_bd_ports sys_clock] [get_bd_pins clk_wiz/clk_in1]
connect_bd_net -net reset_rtl_1 [get_bd_ports reset] [get_bd_pins clk_wiz/resetn] [get_bd_pins rst_clk_wiz_100M/ext_reset_in]
connect_bd_net -net rst_clk_wiz_150M_interconnect_aresetn [get_bd_pins rst_clk_wiz_100M/interconnect_aresetn] \
  [get_bd_pins microblaze_PLC_RS485_axi_periph/ARESETN] [get_bd_pins microblaze_PLCM_axi_periph/ARESETN] \
  [get_bd_pins microblaze_PLC_Ethernet_axi_periph_b/ARESETN] [get_bd_pins microblaze_PLC_Ethernet_axi_periph/ARESETN]
connect_bd_net -net S00_ARESETN_1 [get_bd_pins rst_clk_wiz_100M/peripheral_aresetn] \
  [get_bd_pins microblaze_PLC_RS485_axi_periph/S00_ARESETN] [get_bd_pins microblaze_PLC_RS485_axi_periph/M00_ARESETN] \
  [get_bd_pins microblaze_PLCM_axi_periph/M00_ARESETN] [get_bd_pins microblaze_PLCM_axi_periph/S00_ARESETN] \
  [get_bd_pins microblaze_PLCM_axi_intc/s_axi_aresetn] [get_bd_pins microblaze_PLC_RS485_axi_intc/s_axi_aresetn] \
  [get_bd_pins microblaze_PLC_RS485_axi_periph/M01_ARESETN] [get_bd_pins axi_bram_ctrl_PLC_RS485/s_axi_aresetn] \
  [get_bd_pins microblaze_PLCM_axi_periph/M01_ARESETN] [get_bd_pins axi_bram_ctrl_1_PLCM/s_axi_aresetn] \
  [get_bd_pins axi_uartlite_PLC_RS485/s_axi_aresetn] [get_bd_pins microblaze_PLC_RS485_axi_periph/M02_ARESETN] \
  [get_bd_pins axi_uartlite_PLCM/s_axi_aresetn] [get_bd_pins microblaze_PLC_RS485_axi_periph/M03_ARESETN] \
  [get_bd_pins microblaze_PLCM_axi_periph/M02_ARESETN] [get_bd_pins AXI_GPIO_PLC_RS485_Uart_Rx/s_axi_aresetn] \
  [get_bd_pins AXI_GPIO_PLCM_Uart_Rx/s_axi_aresetn] [get_bd_pins AXI_GPIO_PLCM_Uart_Tx/s_axi_aresetn] \
  [get_bd_pins microblaze_PLC_RS485_axi_periph/M04_ARESETN] [get_bd_pins microblaze_PLCM_axi_periph/M03_ARESETN] \
  [get_bd_pins microblaze_PLCM_axi_periph/M04_ARESETN] [get_bd_pins AXI_GPIO_PLC_RS485_Wire2/s_axi_aresetn] \
  [get_bd_pins AXI_GPIO_PLC_RS485_Wire1/s_axi_aresetn] [get_bd_pins microblaze_PLC_RS485_axi_periph/M05_ARESETN] \
  [get_bd_pins AXI_GPIO_PLCM_Wire2/s_axi_aresetn] [get_bd_pins AXI_GPIO_PLCM_Wire1/s_axi_aresetn] \
  [get_bd_pins microblaze_PLCM_axi_periph/M05_ARESETN] [get_bd_pins microblaze_PLCM_axi_periph/M06_ARESETN] \
  [get_bd_pins axi_quad_spi_PLCM/s_axi_aresetn] [get_bd_pins microblaze_PLCM_axi_periph/M07_ARESETN] \
  [get_bd_pins microblaze_PLC_Ethernet_axi_periph/S00_ARESETN] [get_bd_pins microblaze_PLC_Ethernet_axi_periph/M00_ARESETN] \
  [get_bd_pins microblaze_PLC_Ethernet_axi_intc/s_axi_aresetn] [get_bd_pins microblaze_PLC_Ethernet_axi_periph/M01_ARESETN] \
  [get_bd_pins microblaze_PLC_Ethernet_axi_periph/M02_ARESETN] [get_bd_pins axi_quad_spi_PLC_Ethernet/s_axi_aresetn] \
  [get_bd_pins axi_bram_ctrl_PLC_Ethernet/s_axi_aresetn] [get_bd_pins axi_bram_ctrl_2_PLCM/s_axi_aresetn] \
  [get_bd_pins microblaze_PLCM_axi_periph/M08_ARESETN] [get_bd_pins microblaze_PLC_Ethernet_axi_periph_b/S00_ARESETN] \
  [get_bd_pins microblaze_PLC_Ethernet_axi_periph_b/M00_ARESETN] \
  [get_bd_pins microblaze_PLC_Ethernet_axi_periph_b/M01_ARESETN] \
  [get_bd_pins microblaze_PLC_Ethernet_axi_periph_b/M02_ARESETN] [get_bd_pins axi_quad_spi_PLC_Ethernet_b/s_axi_aresetn] \
  [get_bd_pins axi_bram_ctrl_PLC_Ethernet_b/s_axi_aresetn] [get_bd_pins microblaze_PLC_Ethernet_axi_intc_b/s_axi_aresetn] \
  [get_bd_pins microblaze_PLCM_axi_periph/M09_ARESETN] [get_bd_pins axi_bram_ctrl_3_PLCM/s_axi_aresetn] \
  [get_bd_pins AXI_GPIO_PLC_RS485_Uart_Tx/s_axi_aresetn] [get_bd_pins microblaze_PLC_RS485_axi_periph/M06_ARESETN]
connect_bd_net -net axi_uartlite_PLC_interrupt [get_bd_pins axi_uartlite_PLC_RS485/interrupt] [get_bd_pins microblaze_PLC_RS485_axi_intc/intr]
connect_bd_net [get_bd_pins xlconcat_interrupts_PLCM/dout] [get_bd_pins microblaze_PLCM_axi_intc/intr]
connect_bd_net [get_bd_pins axi_quad_spi_PLCM/ip2intc_irpt] [get_bd_pins xlconcat_interrupts_PLCM/In0]
connect_bd_net [get_bd_pins axi_uartlite_PLCM/interrupt] [get_bd_pins xlconcat_interrupts_PLCM/In1]
connect_bd_net -net microblaze_0_Clk [get_bd_pins clk_wiz/clk_out100] \
  [get_bd_pins microblaze_PLC_RS485/Clk] [get_bd_pins microblaze_PLC_RS485_axi_periph/ACLK] \
  [get_bd_pins microblaze_PLC_RS485_axi_periph/S00_ACLK] [get_bd_pins microblaze_PLC_RS485_axi_periph/M00_ACLK] \
  [get_bd_pins microblaze_PLC_RS485_axi_intc/s_axi_aclk] [get_bd_pins microblaze_PLC_RS485_axi_intc/processor_clk] \
  [get_bd_pins microblaze_PLC_RS485_local_memory/LMB_Clk] [get_bd_pins rst_clk_wiz_100M/slowest_sync_clk] \
  [get_bd_pins microblaze_PLCM/Clk] [get_bd_pins microblaze_PLCM_axi_periph/ACLK] \
  [get_bd_pins microblaze_PLCM_axi_periph/S00_ACLK] [get_bd_pins microblaze_PLCM_axi_periph/M00_ACLK] \
  [get_bd_pins microblaze_PLCM_axi_intc/s_axi_aclk] [get_bd_pins microblaze_PLCM_axi_intc/processor_clk] \
  [get_bd_pins microblaze_PLCM_local_memory/LMB_Clk] [get_bd_pins microblaze_PLC_RS485_axi_periph/M01_ACLK] \
  [get_bd_pins axi_bram_ctrl_PLC_RS485/s_axi_aclk] [get_bd_pins microblaze_PLCM_axi_periph/M01_ACLK] \
  [get_bd_pins axi_bram_ctrl_1_PLCM/s_axi_aclk] [get_bd_pins axi_uartlite_PLC_RS485/s_axi_aclk] \
  [get_bd_pins microblaze_PLC_RS485_axi_periph/M02_ACLK] [get_bd_pins axi_uartlite_PLCM/s_axi_aclk] \
  [get_bd_pins microblaze_PLC_RS485_axi_periph/M03_ACLK] [get_bd_pins microblaze_PLCM_axi_periph/M02_ACLK] \
  [get_bd_pins AXI_GPIO_PLC_RS485_Uart_Rx/s_axi_aclk] [get_bd_pins AXI_GPIO_PLCM_Uart_Tx/s_axi_aclk] \
  [get_bd_pins AXI_GPIO_PLCM_Uart_Rx/s_axi_aclk] [get_bd_pins microblaze_PLC_RS485_axi_periph/M04_ACLK] \
  [get_bd_pins microblaze_PLCM_axi_periph/M03_ACLK] [get_bd_pins microblaze_PLCM_axi_periph/M04_ACLK] \
  [get_bd_pins AXI_GPIO_PLC_RS485_Wire2/s_axi_aclk] [get_bd_pins AXI_GPIO_PLC_RS485_Wire1/s_axi_aclk] \
  [get_bd_pins microblaze_PLC_RS485_axi_periph/M05_ACLK] [get_bd_pins AXI_GPIO_PLCM_Wire1/s_axi_aclk] \
  [get_bd_pins AXI_GPIO_PLCM_Wire2/s_axi_aclk] [get_bd_pins microblaze_PLCM_axi_periph/M05_ACLK] \
  [get_bd_pins microblaze_PLCM_axi_periph/M06_ACLK] [get_bd_pins axi_quad_spi_PLCM/s_axi_aclk] \
  [get_bd_pins microblaze_PLCM_axi_periph/M07_ACLK] [get_bd_pins microblaze_PLC_Ethernet/Clk] \
  [get_bd_pins microblaze_PLC_Ethernet_axi_periph/ACLK] [get_bd_pins microblaze_PLC_Ethernet_axi_periph/S00_ACLK] \
  [get_bd_pins microblaze_PLC_Ethernet_axi_periph/M00_ACLK] [get_bd_pins microblaze_PLC_Ethernet_axi_intc/s_axi_aclk] \
  [get_bd_pins microblaze_PLC_Ethernet_axi_intc/processor_clk] [get_bd_pins microblaze_PLC_Ethernet_axi_periph/M01_ACLK] \
  [get_bd_pins microblaze_PLC_Ethernet_axi_periph/M02_ACLK] [get_bd_pins axi_quad_spi_PLC_Ethernet/s_axi_aclk] \
  [get_bd_pins axi_bram_ctrl_2_PLCM/s_axi_aclk] [get_bd_pins axi_bram_ctrl_PLC_Ethernet/s_axi_aclk] \
  [get_bd_pins microblaze_PLCM_axi_periph/M08_ACLK] [get_bd_pins microblaze_PLC_Ethernet_local_memory/LMB_Clk] \
  [get_bd_pins microblaze_PLC_Ethernet_b/Clk] [get_bd_pins microblaze_PLC_Ethernet_local_memory_b/LMB_Clk] \
  [get_bd_pins microblaze_PLC_Ethernet_axi_periph_b/ACLK] [get_bd_pins microblaze_PLC_Ethernet_axi_periph_b/S00_ACLK] \
  [get_bd_pins microblaze_PLC_Ethernet_axi_periph_b/M00_ACLK] [get_bd_pins microblaze_PLC_Ethernet_axi_periph_b/M01_ACLK] \
  [get_bd_pins microblaze_PLC_Ethernet_axi_periph_b/M02_ACLK] [get_bd_pins axi_quad_spi_PLC_Ethernet_b/s_axi_aclk] \
  [get_bd_pins axi_bram_ctrl_PLC_Ethernet_b/s_axi_aclk] [get_bd_pins microblaze_PLC_Ethernet_axi_intc_b/processor_clk] \
  [get_bd_pins microblaze_PLC_Ethernet_axi_intc_b/s_axi_aclk] [get_bd_pins microblaze_PLCM_axi_periph/M09_ACLK] \
  [get_bd_pins axi_bram_ctrl_3_PLCM/s_axi_aclk] [get_bd_pins AXI_GPIO_PLC_RS485_Uart_Tx/s_axi_aclk] \
  [get_bd_pins microblaze_PLC_RS485_axi_periph/M06_ACLK]
connect_bd_net [get_bd_pins clk_wiz/clk_out28] \
  [get_bd_pins axi_quad_spi_PLCM/ext_spi_clk] [get_bd_pins axi_quad_spi_PLC_Ethernet/ext_spi_clk] \
  [get_bd_pins axi_quad_spi_PLC_Ethernet_b/ext_spi_clk]
connect_bd_net [get_bd_pins axi_quad_spi_PLCM/io0_o] [get_bd_ports PLCM_mosi]
connect_bd_net -net io1_i_0_1 [get_bd_ports PLCM_miso] [get_bd_pins axi_quad_spi_PLCM/io1_i]
connect_bd_net [get_bd_pins axi_quad_spi_PLCM/sck_o] [get_bd_ports PLCM_slave_clk]
connect_bd_net [get_bd_pins axi_quad_spi_PLCM/ss_o] [get_bd_ports PLCM_slave_select]
connect_bd_net -net axi_quad_spi_PLCM_io0_o1 [get_bd_pins axi_quad_spi_PLC_Ethernet/io0_o] [get_bd_ports PLC_Ethernet_mosi]
connect_bd_net -net axi_quad_spi_PLCM_sck_o1 [get_bd_pins axi_quad_spi_PLC_Ethernet/sck_o] [get_bd_ports PLC_Ethernet_slave_clk]
connect_bd_net -net axi_quad_spi_PLCM_ss_o1 [get_bd_pins axi_quad_spi_PLC_Ethernet/ss_o] [get_bd_ports PLC_Ethernet_slave_select]
connect_bd_net -net io1_i_0_2 [get_bd_ports PLC_Ethernet_miso] [get_bd_pins axi_quad_spi_PLC_Ethernet/io1_i]
connect_bd_net [get_bd_pins axi_quad_spi_PLC_Ethernet/ip2intc_irpt] [get_bd_pins microblaze_PLC_Ethernet_axi_intc/intr]
connect_bd_net -net axi_quad_spi_PLC_Ethernet1_ip2intc_irpt [get_bd_pins axi_quad_spi_PLC_Ethernet_b/ip2intc_irpt] \
  [get_bd_pins microblaze_PLC_Ethernet_axi_intc_b/intr]
connect_bd_net -net axi_quad_spi_PLC_Ethernet1_io0_o [get_bd_pins axi_quad_spi_PLC_Ethernet_b/io0_o] [get_bd_ports PLC_Ethernet_mosi_b]
connect_bd_net -net PLCM_miso1_1 [get_bd_ports PLC_Ethernet_miso_b] [get_bd_pins axi_quad_spi_PLC_Ethernet_b/io1_i]
connect_bd_net -net axi_quad_spi_PLC_Ethernet1_sck_o [get_bd_pins axi_quad_spi_PLC_Ethernet_b/sck_o] [get_bd_ports PLC_Ethernet_slave_clk_b]
connect_bd_net -net axi_quad_spi_PLC_Ethernet1_ss_o [get_bd_pins axi_quad_spi_PLC_Ethernet_b/ss_o] [get_bd_ports PLC_Ethernet_slave_select_b]
set_property HDL_ATTRIBUTE.BMM_INFO_PROCESSOR {microblaze-le > design_1 microblaze_PLC_RS485_local_memory/dlmb_bram_if_cntlr design_1 axi_bram_ctrl_PLC_RS485} [get_bd_cells microblaze_PLC_RS485]
set_property HDL_ATTRIBUTE.KEEP_HIERARCHY yes [get_bd_cells microblaze_PLC_RS485]
set_property HDL_ATTRIBUTE.BMM_INFO_PROCESSOR {microblaze-le > design_1 microblaze_PLCM_local_memory/dlmb_bram_if_cntlr design_1 axi_bram_ctrl_1_PLCM design_1 axi_bram_ctrl_3_PLCM design_1 axi_bram_ctrl_2_PLCM} [get_bd_cells microblaze_PLCM]
set_property HDL_ATTRIBUTE.KEEP_HIERARCHY yes [get_bd_cells microblaze_PLCM]
set_property HDL_ATTRIBUTE.BMM_INFO_ADDRESS_SPACE {byte  0xC0000000 32 > design_1 MDBRAM_PLCM_PLC_RS485/Shared_Memory_PLCM_PLC_RS485} [get_bd_cells axi_bram_ctrl_PLC_RS485]
set_property HDL_ATTRIBUTE.KEEP_HIERARCHY yes [get_bd_cells axi_bram_ctrl_PLC_RS485]
set_property HDL_ATTRIBUTE.BMM_INFO_ADDRESS_SPACE {byte  0xC0000000 32 > design_1 MDBRAM_PLCM_PLC_RS485/Shared_Memory_PLCM_PLC_RS485} [get_bd_cells axi_bram_ctrl_1_PLCM]
set_property HDL_ATTRIBUTE.KEEP_HIERARCHY yes [get_bd_cells axi_bram_ctrl_1_PLCM]
set_property HDL_ATTRIBUTE.BMM_INFO_PROCESSOR {microblaze-le > design_1 microblaze_PLC_Ethernet_local_memory/dlmb_bram_if_cntlr design_1 axi_bram_ctrl_PLC_Ethernet} [get_bd_cells microblaze_PLC_Ethernet]
set_property HDL_ATTRIBUTE.KEEP_HIERARCHY yes [get_bd_cells microblaze_PLC_Ethernet]
set_property HDL_ATTRIBUTE.BMM_INFO_ADDRESS_SPACE {byte  0xC2000000 32 > design_1 MDBRAM_PLCM_PLC_Ethernet/Shared_Memory_PLCM_PLC_Ethernet} [get_bd_cells axi_bram_ctrl_2_PLCM]
set_property HDL_ATTRIBUTE.KEEP_HIERARCHY yes [get_bd_cells axi_bram_ctrl_2_PLCM]
set_property HDL_ATTRIBUTE.BMM_INFO_ADDRESS_SPACE {byte  0xC2000000 32 > design_1 MDBRAM_PLCM_PLC_Ethernet/Shared_Memory_PLCM_PLC_Ethernet} [get_bd_cells axi_bram_ctrl_PLC_Ethernet]
set_property HDL_ATTRIBUTE.KEEP_HIERARCHY yes [get_bd_cells axi_bram_ctrl_PLC_Ethernet]
set_property HDL_ATTRIBUTE.BMM_INFO_ADDRESS_SPACE {byte  0xC2000000 32 > design_1 MDBRAM_PLCM_PLC_Ethernet_b/Shared_Memory_PLCM_PLC_Ethernet} [get_bd_cells axi_bram_ctrl_PLC_Ethernet_b]
set_property HDL_ATTRIBUTE.KEEP_HIERARCHY yes [get_bd_cells axi_bram_ctrl_PLC_Ethernet_b]
set_property HDL_ATTRIBUTE.BMM_INFO_PROCESSOR {microblaze-le > design_1 microblaze_PLC_Ethernet_local_memory_b/dlmb_bram_if_cntlr design_1 axi_bram_ctrl_PLC_Ethernet_b} [get_bd_cells microblaze_PLC_Ethernet_b]
set_property HDL_ATTRIBUTE.KEEP_HIERARCHY yes [get_bd_cells microblaze_PLC_Ethernet_b]
set_property HDL_ATTRIBUTE.BMM_INFO_ADDRESS_SPACE {byte  0xC1000000 32 > design_1 MDBRAM_PLCM_PLC_Ethernet_b/Shared_Memory_PLCM_PLC_Ethernet} [get_bd_cells axi_bram_ctrl_3_PLCM]
set_property HDL_ATTRIBUTE.KEEP_HIERARCHY yes [get_bd_cells axi_bram_ctrl_3_PLCM]
